# EAGLE design Project_2 (EAGLE 9.6.2)
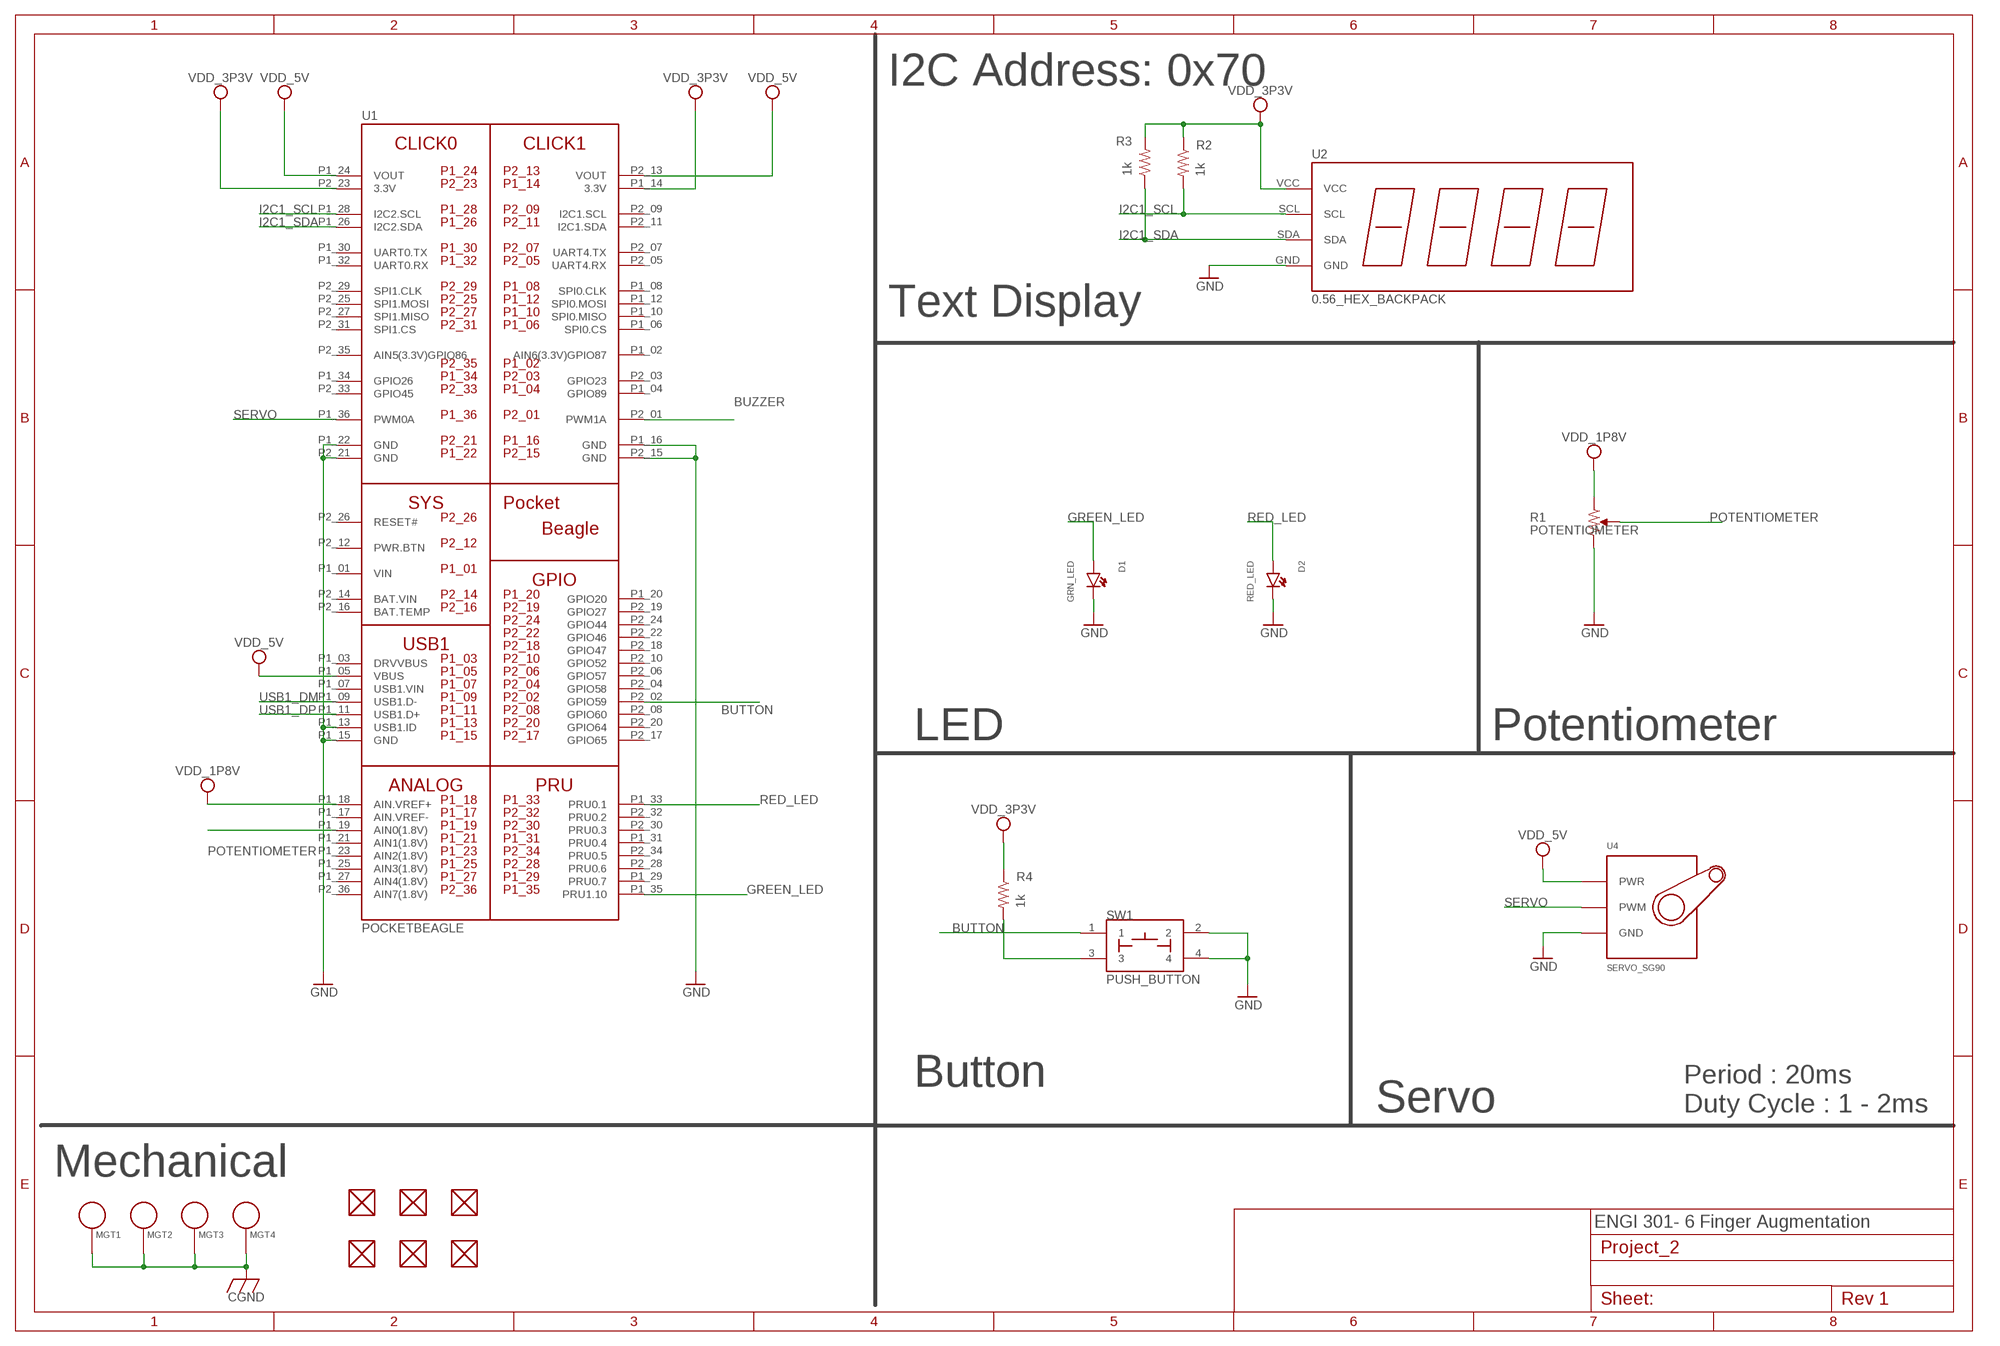
[diagram p0: schematic, sheet 1]

## Parts
D1  GRN_LED  LED  [EIA-STD]
D2  RED_LED  LED  [EIA-STD]
FUD1  FIDUCIAL  [FIDUCIAL_40MIL]
FUD2  FIDUCIAL  [FIDUCIAL_40MIL]
FUD3  FIDUCIAL  [FIDUCIAL_40MIL]
FUD4  FIDUCIAL  [FIDUCIAL_40MIL]
FUD5  FIDUCIAL  [FIDUCIAL_40MIL]
FUD6  FIDUCIAL  [FIDUCIAL_40MIL]
MGT1  MOUNTING_HOLE  [MOUNTING_HOLE]
MGT2  MOUNTING_HOLE  [MOUNTING_HOLE]
MGT3  MOUNTING_HOLE  [MOUNTING_HOLE]
MGT4  MOUNTING_HOLE  [MOUNTING_HOLE]
R1  POTENTIOMETER  [POT-PO90S]
R2  1k  R_R0603  [R0603]
R3  1k  R_R0603  [R0603]
R4  1k  R_R0603  [R0603]
SW1  PUSH_BUTTON  [BUTTON_12.5MM]
U1  POCKETBEAGLE  [POCKETBEAGLE]
U2  0.56_HEX_BACKPACK  [0.56_HEX_BACKPACK]
U4  SERVO_SG90  [SERVO-X1]

## Nets
BUTTON: R4.2 SW1.1 SW1.3 U1.P2_02(GPIO59)
BUZZER: U1.P2_01(PWM1A)
CGND: MGT1.P$1 MGT2.P$1 MGT3.P$1 MGT4.P$1
GND: D1.CATHODE D2.CATHODE R1.CW SW1.2 SW1.4 U1.P1_13(USB1.ID) U1.P1_15(GND) U1.P1_16(GND) U1.P1_22(GND) U1.P2_15(GND) U1.P2_21(GND) U2.GND U4.GND
GREEN_LED: D1.ANODE U1.P1_35(PRU1.10)
I2C1_SCL: R2.2 U1.P1_28(I2C2.SCL) U2.SCL
I2C1_SDA: R3.1 U1.P1_26(I2C2.SDA) U2.SDA
POTENTIOMETER: R1.S U1.P1_19(AIN0(1.8V))
RED_LED: D2.ANODE U1.P1_33(PRU0.1)
SERVO: U1.P1_36(PWM0A) U4.SIG(PWM)
USB1_DM: U1.P1_09(USB1.D-)
USB1_DP: U1.P1_11(USB1.D+)
VDD_1P8V: R1.CCW U1.P1_18(AIN.VREF+)
VDD_3P3V: R2.1 R3.2 R4.1 U1.P1_14(3.3V) U1.P2_23(3.3V) U2.VCC
VDD_5V: U1.P1_05(VBUS) U1.P1_24(VOUT) U1.P2_13(VOUT) U4.PWR
Unconnected: FUD1.P$1 FUD2.P$1 FUD3.P$1 FUD4.P$1 FUD5.P$1 FUD6.P$1 U1.P1_02(AIN6(3.3V)GPIO87) U1.P1_03(DRVVBUS) U1.P1_04(GPIO89) U1.P1_06(SPI0.CS) U1.P1_07(USB1.VIN) U1.P1_08(SPI0.CLK) U1.P1_10(SPI0.MISO) U1.P1_12(SPI0.MOSI) U1.P1_17(AIN.VREF-) U1.P1_20(GPIO20) U1.P1_21(AIN1(1.8V)) U1.P1_23(AIN2(1.8V)) U1.P1_25(AIN3(1.8V)) U1.P1_27(AIN4(1.8V)) U1.P1_29(PRU0.7) U1.P1_30(UART0.TX) U1.P1_31(PRU0.4) U1.P1_32(UART0.RX) U1.P1_34(GPIO26) U1.P2_03(GPIO23) U1.P2_04(GPIO58) U1.P2_05(UART4.RX) U1.P2_06(GPIO57) U1.P2_07(UART4.TX) U1.P2_08(GPIO60) U1.P2_09(I2C1.SCL) U1.P2_10(GPIO52) U1.P2_11(I2C1.SDA) U1.P2_12(PWR.BTN) U1.P2_16(BAT.TEMP) U1.P2_17(GPIO65) U1.P2_18(GPIO47) U1.P2_19(GPIO27) U1.P2_20(GPIO64) U1.P2_22(GPIO46) U1.P2_24(GPIO44) U1.P2_25(SPI1.MOSI) U1.P2_26(RESET#) U1.P2_27(SPI1.MISO) U1.P2_28(PRU0.6) U1.P2_29(SPI1.CLK) U1.P2_30(PRU0.3) U1.P2_31(SPI1.CS) U1.P2_32(PRU0.2) U1.P2_33(GPIO45) U1.P2_34(PRU0.5) U1.P2_35(AIN5(3.3V)GPIO86) U1.P2_36(AIN7(1.8V))

## Notes on the sheet
- I2C Address: 0x70
- Text Display
- LED | Potentiometer
- Button
- Servo
- Period : 20ms
  Duty Cycle : 1 - 2ms
- Mechanical
- ENGI 301- 6 Finger Augmentation

## Power pins joined to a net without a drawn wire
BAT.VIN: U1.P2_14(BAT.VIN)
VIN: U1.P1_01(VIN)

## Library data of the parts
D1 D2 = combo_lock:LED: EIA-STD LED, LTST-C191TBKT
FUD1-FUD6 = combo_lock:FIDUCIAL
MGT1-MGT4 = combo_lock:MOUNTING_HOLE: Chassis Mounting Hole w/GND connection ability
R1 = combo_lock:POTENTIOMETER: Potentiometer - Examples: P090S-14T20BR10K (987-1277-ND)
R2-R4 = combo_lock:R_: RESISTOR, American symbol
SW1 = combo_lock:PUSH_BUTTON
U1 = combo_lock:POCKETBEAGLE
U2 = combo_lock:0.56_HEX_BACKPACK: 0.56" LED HEX Backback - Adafruit HT16K33 - https://www.adafruit.com/product/878 - https://www.adafruit.com/product/879 - https://www.adafruit.com/product/880 - https://www.adafruit.com/product/881 - https://www.adafruit.com/product/1002
U4 = combo_lock:SERVO_SG90

## Board
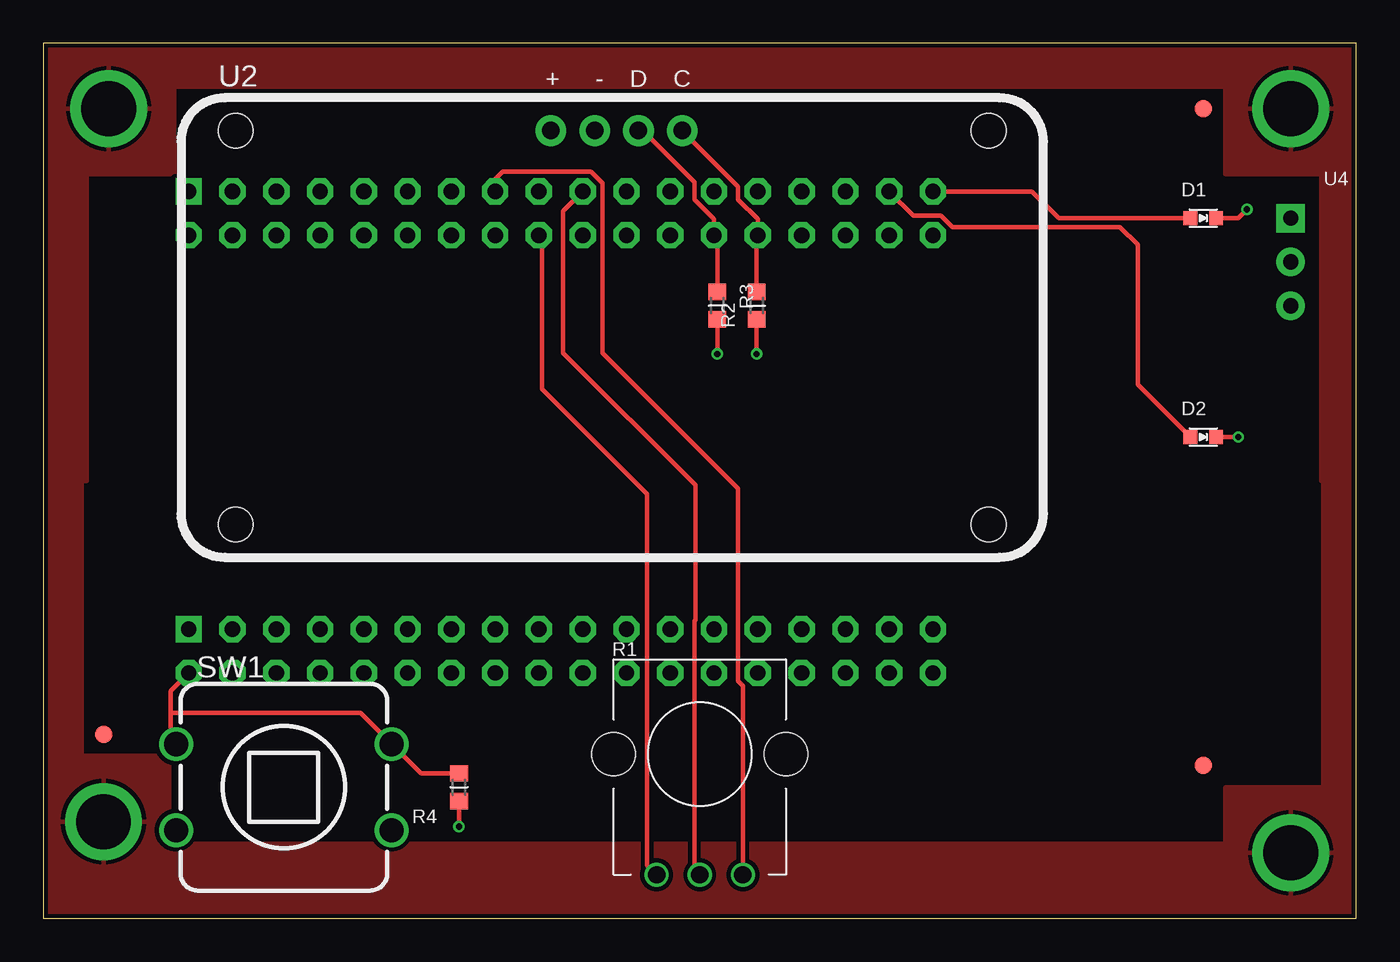
[diagram p1: board, top side]
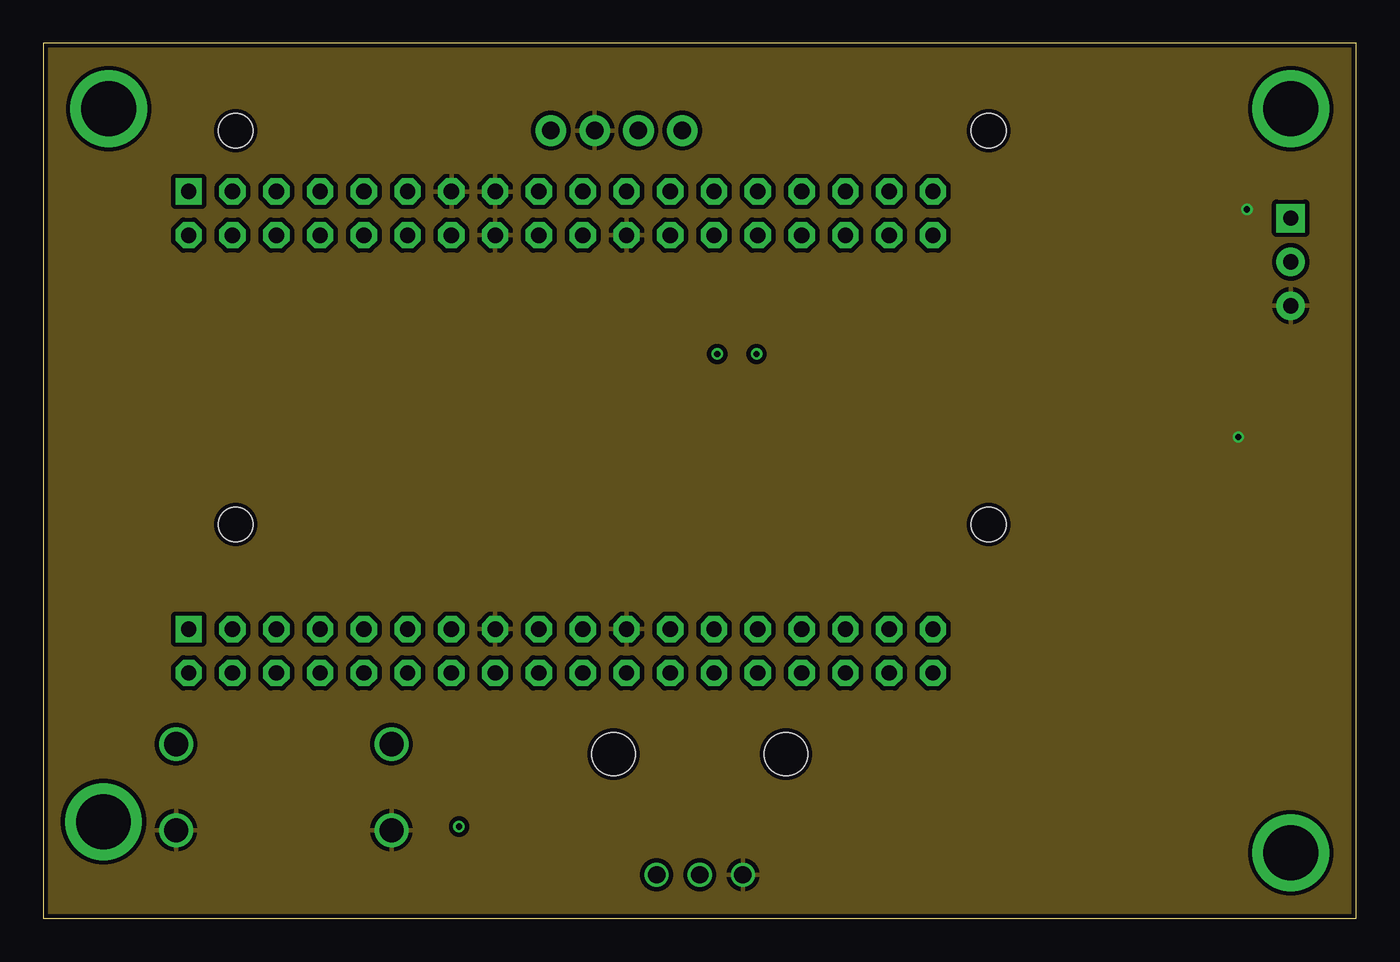
[diagram p2: board, inner layer Route2]
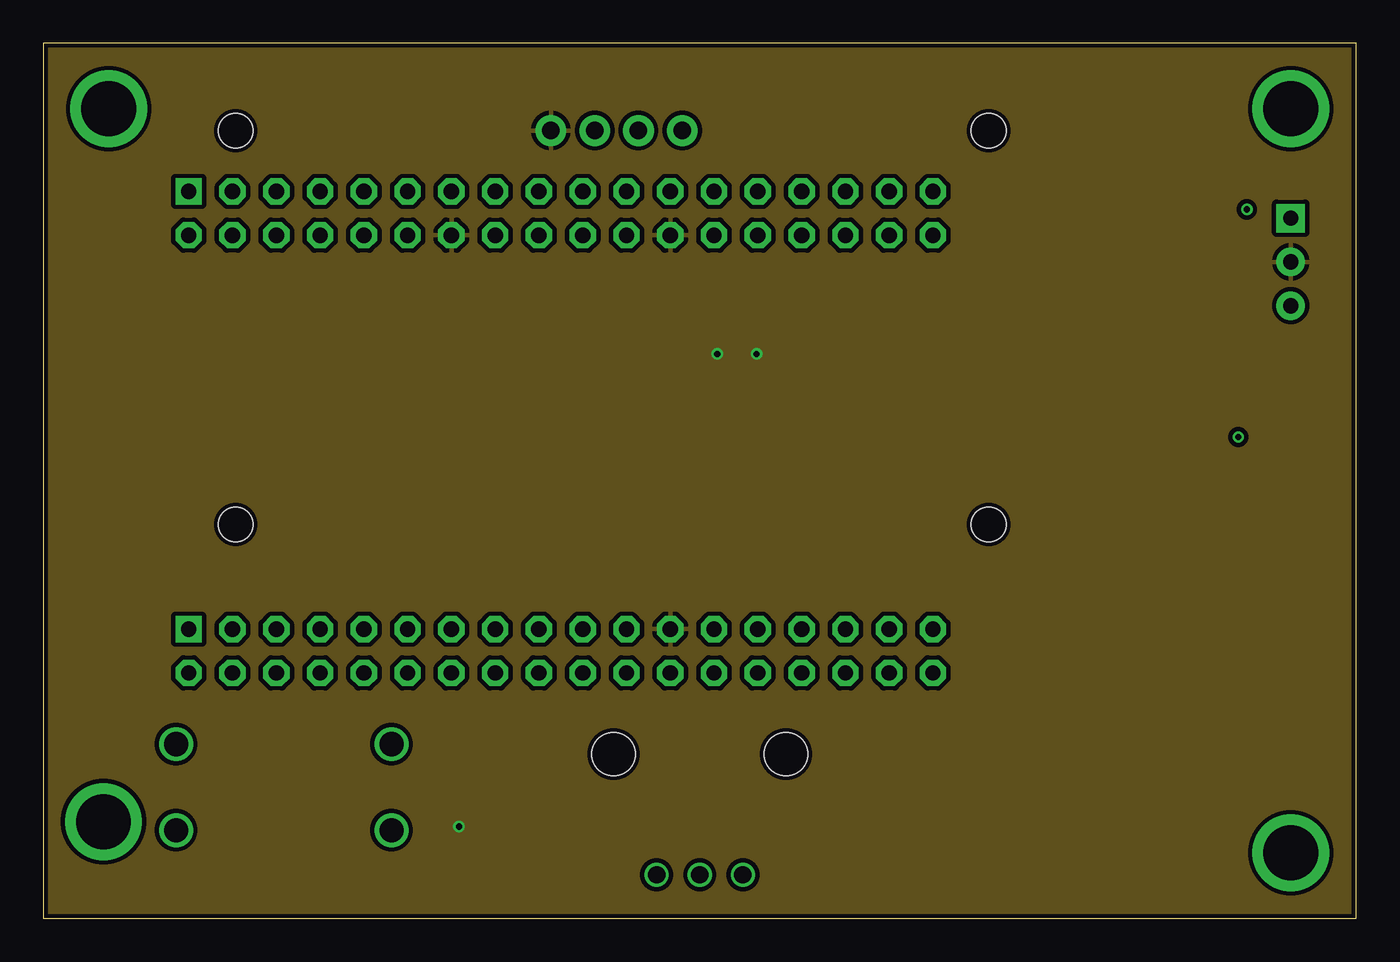
[diagram p3: board, inner layer Route15]
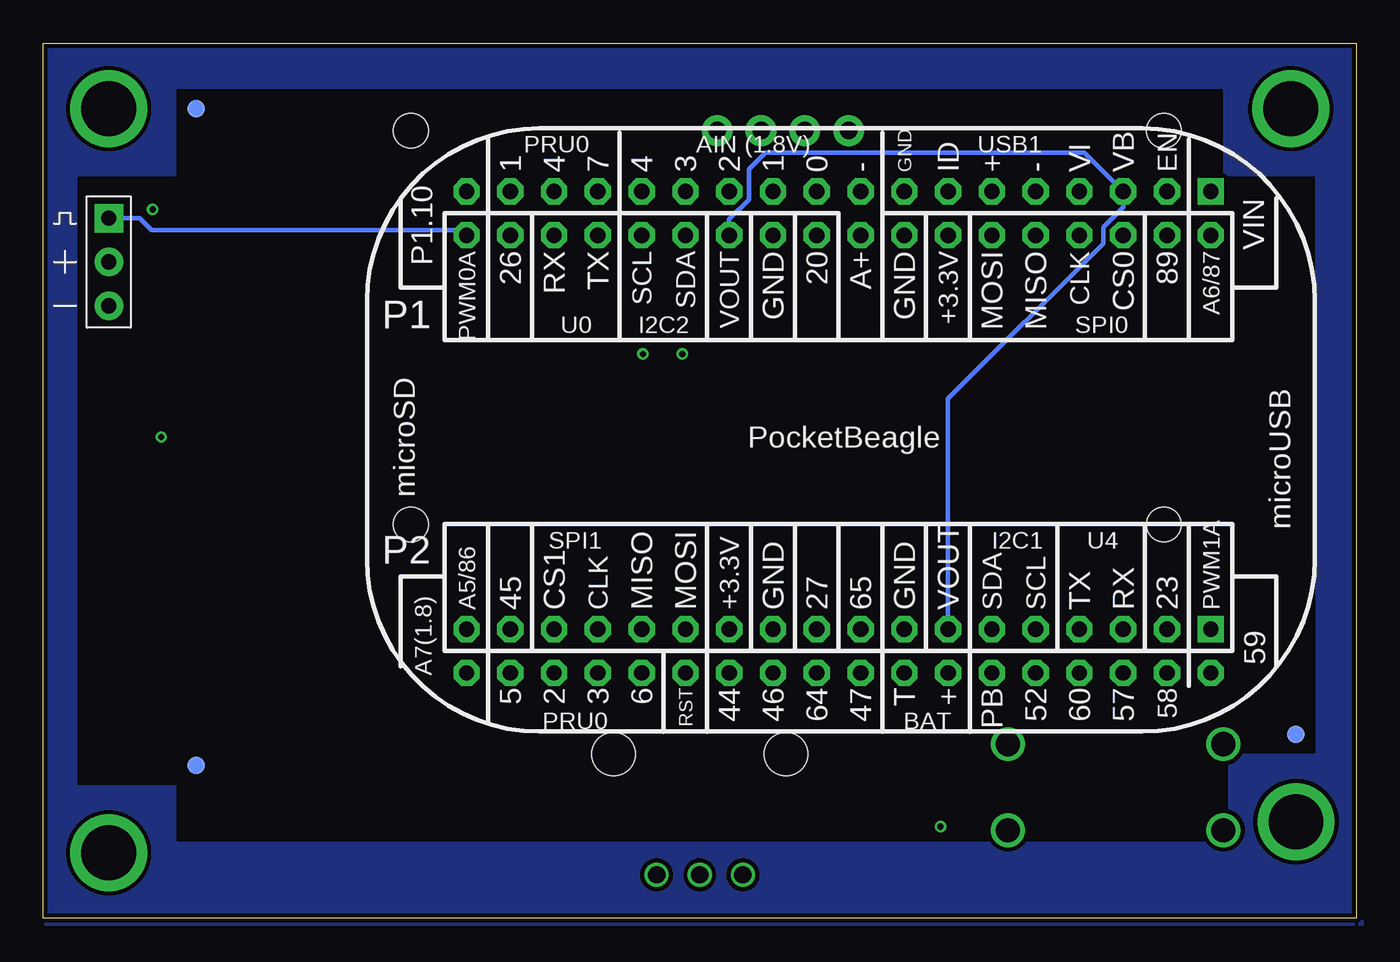
[diagram p4: board, bottom side, seen from below]

Size 76.2 x 50.8 mm. Coordinates in mm from the lower left corner, seen from the top.
Outline: 0,0 76.2,0 76.2,50.8 0,50.8 0,0
Copper layers (1*2*15*16): Top 0.035mm / dielectric 0.23mm / Route2 0.035mm / dielectric 0.93mm / Route15 0.035mm / dielectric 0.23mm / Bottom 0.035mm
Design rules "ENGI301_4lyr": minimum track width 10mil, minimum drill 12mil, track to track 10mil, track to pad 10mil, pad to pad 10mil, via to via 10mil, smd to smd 10mil, copper to edge 10mil, drill to drill 12mil, minimum pad ring 6mil, minimum via ring 6mil, stop-mask expansion 3mil, vias tented up to drill 25mil, thermal gap 10mil

### Footprints (pad centres in the part's own frame; a part is rotated, then mirrored left to right if it is on the bottom)
EIA-STD = smd 0.8 x 0.8: ANODE -0.75,0; CATHODE 0.75,0
FIDUCIAL_40MIL = smd 1.016 x 1.016: P$1 0,0
MOUNTING_HOLE = drill 3.175 pad 4.445: P$1 0,0
POT-PO90S = drill 1: CCW -2.5,0; CW 2.5,0; S 0,0 | hole 2.5: -5,7; 5,7
R0603 = smd 0.95 x 1.031: 1 -0.8,0; 2 0.8,0
BUTTON_12.5MM = drill 1.4: 1 -6.25,2.5; 2 -6.25,-2.5; 3 6.25,2.5; 4 6.25,-2.5
POCKETBEAGLE = drill 0.889 pad 1.524 square: P1_01 5.91,3.53; P2_01 5.91,28.93 | drill 0.889 pad 1.524 octagon: P1_02 5.91,6.07; P1_03 8.45,3.53; P1_04 8.45,6.07; P1_05 10.99,3.53; P1_06 10.99,6.07; P1_07 13.53,3.53; P1_08 13.53,6.07; P1_09 16.07,3.53; P1_10 16.07,6.07; P1_11 18.61,3.53; P1_12 18.61,6.07; P1_13 21.15,3.53; P1_14 21.15,6.07; P1_15 23.69,3.53; P1_16 23.69,6.07; P1_17 26.23,3.53; P1_18 26.23,6.07; P1_19 28.77,3.53; P1_20 28.77,6.07; P1_21 31.31,3.53; P1_22 31.31,6.07; P1_23 33.85,3.53; P1_24 33.85,6.07; P1_25 36.39,3.53; P1_26 36.39,6.07; P1_27 38.93,3.53; P1_28 38.93,6.07; P1_29 41.47,3.53; P1_30 41.47,6.07; P1_31 44.01,3.53; P1_32 44.01,6.07; P1_33 46.55,3.53; P1_34 46.55,6.07; P1_35 49.09,3.53; P1_36 49.09,6.07; P2_02 5.91,31.47; P2_03 8.45,28.93; P2_04 8.45,31.47; P2_05 10.99,28.93; P2_06 10.99,31.47; P2_07 13.53,28.93; P2_08 13.53,31.47; P2_09 16.07,28.93; P2_10 16.07,31.47; P2_11 18.61,28.93; P2_12 18.61,31.47; P2_13 21.15,28.93; P2_14 21.15,31.47; P2_15 23.69,28.93; P2_16 23.69,31.47; P2_17 26.23,28.93; P2_18 26.23,31.47; P2_19 28.77,28.93; P2_20 28.77,31.47; P2_21 31.31,28.93; P2_22 31.31,31.47; P2_23 33.85,28.93; P2_24 33.85,31.47; P2_25 36.39,28.93; P2_26 36.39,31.47; P2_27 38.93,28.93; P2_28 38.93,31.47; P2_29 41.47,28.93; P2_30 41.47,31.47; P2_31 44.01,28.93; P2_32 44.01,31.47; P2_33 46.55,28.93; P2_34 46.55,31.47; P2_35 49.09,28.93; P2_36 49.09,31.47
0.56_HEX_BACKPACK = drill 1.016 pad 1.778: GND -1.016,11.43; SCL 4.064,11.43; SDA 1.524,11.43; VCC -3.556,11.43 | hole 2: -21.844,-11.43; 21.844,-11.43; -21.844,11.43; 21.844,11.43
SERVO-X1 = drill 0.889 pad 1.651: GND 0,-2.54; PWR 0,0 | drill 0.889 pad 1.651 square: SIG 0,2.54

### Placement (x,y rotation side)
D1  67.31,40.64 0 top
D2  67.31,27.94 0 top
FUD1  3.51,10.69 0 top
FUD2  3.51,10.69 0 bottom
FUD3  67.31,8.89 0 top
FUD4  67.31,8.89 0 bottom
FUD5  67.31,46.99 0 top
FUD6  67.31,46.99 0 bottom
MGT1  3.51,5.61 0 top
MGT2  3.81,46.99 0 top
MGT3  72.39,3.81 0 top
MGT4  72.39,46.99 0 top
R1  38.1,2.54 0 top
R2  41.4,35.56 90 top
R3  39.12,35.56 270 top
R4  24.13,7.62 90 top
SW1  13.97,7.62 0 top
U1  2.54,45.72 180 bottom
U2  33.02,34.29 0 top
U4  72.39,38.1 0 bottom

### Tracks (layer width: path | path; a pad name or v marks a point on that pad's centre or on a via)
BUTTON
  Top 0.254: SW1.1 7.42,10.43 7.42,11.96 | 7.42,11.96 7.42,13.21 U1.P2_02 | R4.2 21.92,8.42 SW1.3 18.42,11.92 7.46,11.92 7.42,11.96
CGND
  pour Top: 7.62,43.18 2.54,43.18 2.54,25.4 -2.54,25.4 -2.54,53.34 78.74,53.34 78.74,25.4 74.17,25.4 74.17,43.18 68.58,43.18 68.58,48.26 7.62,48.26
  pour Top: -2.54,25.4 -2.54,-2.54 78.74,-2.54 78.74,25.4 74.27,25.4 74.27,7.62 68.58,7.62 68.58,4.34 7.32,4.34 7.32,9.42 2.24,9.42 2.24,25.4
CGND1
  pour Bottom: 7.62,43.18 2.26,43.18 2.26,25.48 -0.05,25.48 -0.05,50.8 76.1,50.8 76.1,25.4 74.35,25.4 74.35,43.18 68.58,43.18 68.58,48.26 7.62,48.26
  pour Bottom: -0.3,25.4 -0.3,-0.3 76.15,-0.3 76.15,25.4 74.35,25.4 74.35,7.62 68.58,7.62 68.58,4.34 7.32,4.34 7.32,9.42 2.24,9.42 2.24,25.4
GND  (via drill 0.35 pad 0.61)
  Top 0.254: D2.CATHODE v69.34,27.94 | R1.CW 40.6,13.5 40.33,13.78 40.33,24.95 32.45,32.83 32.45,42.66 31.78,43.33 26.67,43.33 26.23,42.89 U1.P1_15 | v69.85,41.15 69.34,40.64 D1.CATHODE
  pour Route2: -2.54,53.34 -2.54,-2.54 78.74,-2.54 78.74,53.34
GREEN_LED
  Top 0.254: D1.ANODE 58.93,40.64 57.38,42.19 U1.P1_35
I2C1_SCL
  Top 0.254: U2.SCL 40.33,42.48 40.33,41.72 41.47,40.57 U1.P1_28 41.4,39.58 R2.2
I2C1_SDA
  Top 0.254: U2.SDA 34.8,45.72 37.79,42.73 37.79,41.72 38.93,40.57 U1.P1_26 39.12,39.46 R3.1
POTENTIOMETER
  Top 0.254: R1.S 37.79,2.85 37.79,17.26 37.85,17.32 37.85,25.15 30.17,32.83 30.17,41.05 U1.P1_19
RED_LED
  Top 0.254: U1.P1_33 50.49,40.79 52.1,40.79 52.76,40.13 62.48,40.13 63.51,39.1 63.51,30.99 D2.ANODE
SERVO
  Bottom 0.254: U4.SIG 70.6,40.64 69.89,39.93 51.91,39.93 U1.P1_36
VDD_1P8V
  Top 0.254: U1.P1_18 28.96,39.46 28.96,30.73 35.05,24.64 35.05,3.09 R1.CCW
VDD_3P3V  (via drill 0.35 pad 0.61)
  Top 0.254: R4.1 v24.13,5.33 | R3.2 v39.12,32.77 | R2.1 v41.4,32.77
  pour Route15: -5.08,55.88 -5.08,-5.08 81.28,-5.08 81.28,55.88
VDD_5V
  Bottom 0.254: U1.P2_13 23.69,30.16 14.67,39.17 14.67,40.12 13.53,41.27 U1.P1_05 15.79,44.45 34.29,44.45 35.25,43.49 35.25,41.72 36.39,40.57 U1.P1_24
  pour Route15: 71.12,38.1 71.12,39.12 73.48,39.12 73.48,37.08 34.54,37.08 34.54,41.15 38.1,41.15 38.1,38.1

### Text on the board
tDocu: ENGI 301 - F22 / PAUL KIM / 6-FIN_AUG
200bmp: C:/Users/bang7/Desktop/zergling for bmp.bmp
201bmp: C:/Users/bang7/Desktop/zergling for bmp.bmp